# EAGLE schematic FPGA_ARM (EAGLE 5.11)
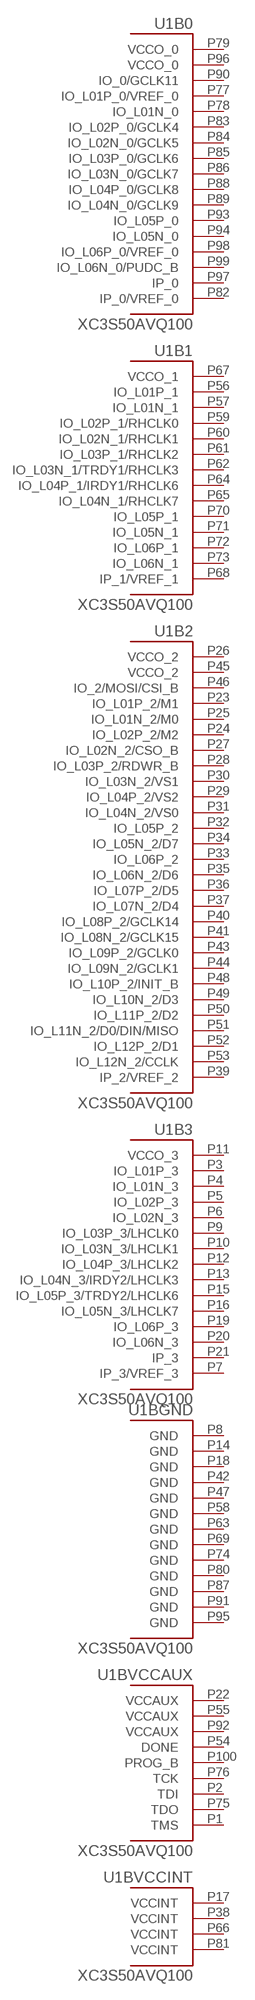
[diagram p0: schematic, sheet 1]

## Parts
U1  XC3S50AVQ100  [VQ100]
Unconnected: U1.P1(BVCCAUX:TMS) U1.P2(BVCCAUX:TDI) U1.P3(B3:IO_L01P_3) U1.P4(B3:IO_L01N_3) U1.P5(B3:IO_L02P_3) U1.P6(B3:IO_L02N_3) U1.P7(B3:IP_3/VREF_3) U1.P9(B3:IO_L03P_3/LHCLK0) U1.P10(B3:IO_L03N_3/LHCLK1) U1.P11(B3:VCCO_3) U1.P12(B3:IO_L04P_3/LHCLK2) U1.P13(B3:IO_L04N_3/IRDY2/LHCLK3) U1.P15(B3:IO_L05P_3/TRDY2/LHCLK6) U1.P16(B3:IO_L05N_3/LHCLK7) U1.P17(BVCCINT:VCCINT) U1.P19(B3:IO_L06P_3) U1.P20(B3:IO_L06N_3) U1.P21(B3:IP_3) U1.P22(BVCCAUX:VCCAUX) U1.P23(B2:IO_L01P_2/M1) U1.P24(B2:IO_L02P_2/M2) U1.P25(B2:IO_L01N_2/M0) U1.P26(B2:VCCO_2) U1.P27(B2:IO_L02N_2/CSO_B) U1.P28(B2:IO_L03P_2/RDWR_B) U1.P29(B2:IO_L04P_2/VS2) U1.P30(B2:IO_L03N_2/VS1) U1.P31(B2:IO_L04N_2/VS0) U1.P32(B2:IO_L05P_2) U1.P33(B2:IO_L06P_2) U1.P34(B2:IO_L05N_2/D7) U1.P35(B2:IO_L06N_2/D6) U1.P36(B2:IO_L07P_2/D5) U1.P37(B2:IO_L07N_2/D4) U1.P38(BVCCINT:VCCINT) U1.P39(B2:IP_2/VREF_2) U1.P40(B2:IO_L08P_2/GCLK14) U1.P41(B2:IO_L08N_2/GCLK15) U1.P43(B2:IO_L09P_2/GCLK0) U1.P44(B2:IO_L09N_2/GCLK1) U1.P45(B2:VCCO_2) U1.P46(B2:IO_2/MOSI/CSI_B) U1.P48(B2:IO_L10P_2/INIT_B) U1.P49(B2:IO_L10N_2/D3) U1.P50(B2:IO_L11P_2/D2) U1.P51(B2:IO_L11N_2/D0/DIN/MISO) U1.P52(B2:IO_L12P_2/D1) U1.P53(B2:IO_L12N_2/CCLK) U1.P54(BVCCAUX:DONE) U1.P55(BVCCAUX:VCCAUX) U1.P56(B1:IO_L01P_1) U1.P57(B1:IO_L01N_1) U1.P59(B1:IO_L02P_1/RHCLK0) U1.P60(B1:IO_L02N_1/RHCLK1) U1.P61(B1:IO_L03P_1/RHCLK2) U1.P62(B1:IO_L03N_1/TRDY1/RHCLK3) U1.P64(B1:IO_L04P_1/IRDY1/RHCLK6) U1.P65(B1:IO_L04N_1/RHCLK7) U1.P66(BVCCINT:VCCINT) U1.P67(B1:VCCO_1) U1.P68(B1:IP_1/VREF_1) U1.P70(B1:IO_L05P_1) U1.P71(B1:IO_L05N_1) U1.P72(B1:IO_L06P_1) U1.P73(B1:IO_L06N_1) U1.P75(BVCCAUX:TDO) U1.P76(BVCCAUX:TCK) U1.P77(B0:IO_L01P_0/VREF_0) U1.P78(B0:IO_L01N_0) U1.P79(B0:VCCO_0) U1.P81(BVCCINT:VCCINT) U1.P82(B0:IP_0/VREF_0) U1.P83(B0:IO_L02P_0/GCLK4) U1.P84(B0:IO_L02N_0/GCLK5) U1.P85(B0:IO_L03P_0/GCLK6) U1.P86(B0:IO_L03N_0/GCLK7) U1.P88(B0:IO_L04P_0/GCLK8) U1.P89(B0:IO_L04N_0/GCLK9) U1.P90(B0:IO_0/GCLK11) U1.P92(BVCCAUX:VCCAUX) U1.P93(B0:IO_L05P_0) U1.P94(B0:IO_L05N_0) U1.P96(B0:VCCO_0) U1.P97(B0:IP_0) U1.P98(B0:IO_L06P_0/VREF_0) U1.P99(B0:IO_L06N_0/PUDC_B) U1.P100(BVCCAUX:PROG_B)

## Power pins joined to a net without a drawn wire
GND: U1.P8(BGND:GND) U1.P14(BGND:GND) U1.P18(BGND:GND) U1.P42(BGND:GND) U1.P47(BGND:GND) U1.P58(BGND:GND) U1.P63(BGND:GND) U1.P69(BGND:GND) U1.P74(BGND:GND) U1.P80(BGND:GND) U1.P87(BGND:GND) U1.P91(BGND:GND) U1.P95(BGND:GND)

## Library data of the parts
U1 = xilinx_devices:XC3S50AVQ100: Xilinx FPGA: XC3S50AVQ100